# Altium schematic sheet 5V.SchDoc
size A4
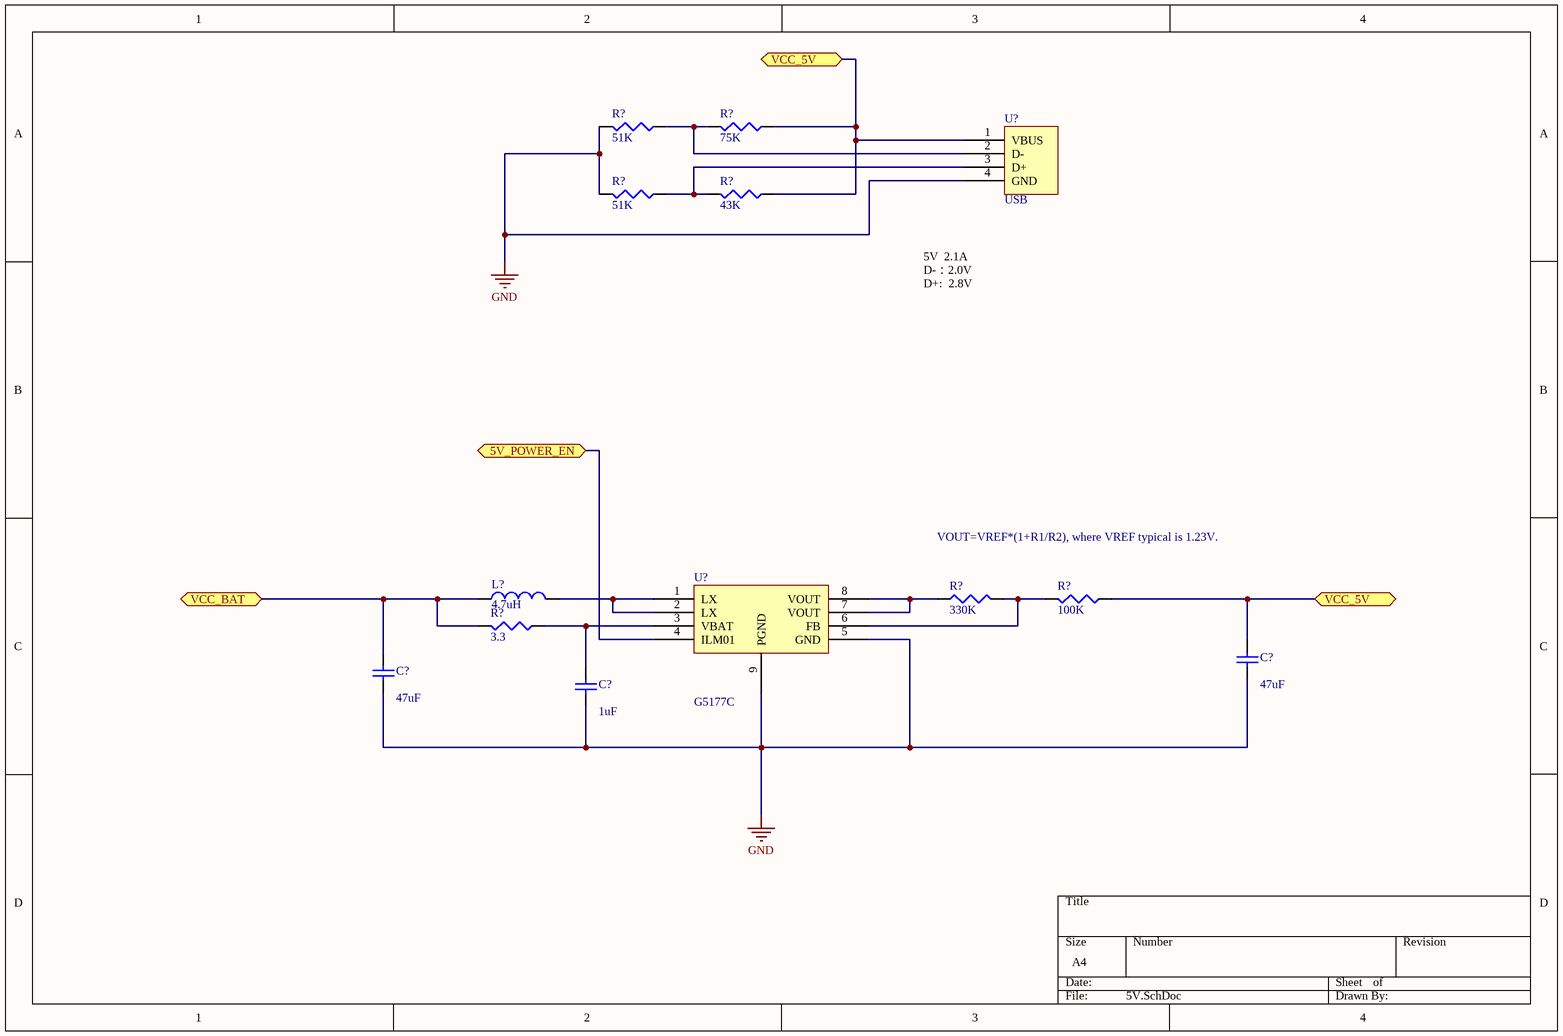
[diagram p0: 5V.SchDoc]

## Parts
(Parts that share a designator on the sheet are numbered #1, #2 ... from top to bottom, then left to right.)
C?#1  value 47uF  [C1206]  (hidden comment: Cap Semi)
C?#2  value 47uF  [C1206]  (hidden comment: Cap Semi)
C?#3  value 1uF  [C1206]  (hidden comment: Cap Semi)
L?  value 4.7uH  [0402-A]  (hidden comment: Inductor)
R?#1  value 51K  [12Z-2010]  (hidden comment: Res3)
R?#2  value 75K  [12Z-2010]  (hidden comment: Res3)
R?#3  value 51K  [12Z-2010]  (hidden comment: Res3)
R?#4  value 43K  [12Z-2010]  (hidden comment: Res3)
R?#5  value 330K  [12Z-2010]  (hidden comment: Res3)
R?#6  value 100K  [12Z-2010]  (hidden comment: Res3)
R?#7  value 3.3  [12Z-2010]  (hidden comment: Res3)
U?#1  USB
U?#2  G5177C

## Ports
5V_POWER_EN (bidir), VCC_5V (bidir), VCC_BAT (bidir)

## Nets
GND: C?#1.1 C?#2.1 C?#3.1 R?#1.2 R?#3.2 U?#1.4(GND) U?#2.5(GND) U?#2.9(PGND)
5V_POWER_EN: U?#2.4(ILM01) ; port 5V_POWER_EN
VCC_5V: C?#1.2 R?#2.1 R?#4.1 R?#6.1 U?#1.1(VBUS) ; port VCC_5V
VCC_BAT: C?#2.2 L?.1 R?#7.2 ; port VCC_BAT
NetC?#3_2: C?#3.2 R?#7.1 U?#2.3(VBAT)
NetL?_2: L?.2 U?#2.1(LX) U?#2.2(LX)
NetR?#1_1: R?#1.1 R?#2.2 U?#1.2(D-)
NetR?#3_1: R?#3.1 R?#4.2 U?#1.3(D+)
NetR?#5_1: R?#5.1 U?#2.7(VOUT) U?#2.8(VOUT)
NetR?#5_2: R?#5.2 R?#6.2 U?#2.6(FB)

## Notes on the sheet
- 5V  2.1A
  D-：2.0V
  D+:  2.8V
- VOUT=VREF*(1+R1/R2), where VREF typical is 1.23V.

## Library data of the parts
C?#1-C?#3 = Cap Semi: Capacitor (Semiconductor SIM Model); Published: 8-Jun-2000; LatestRevisionDate: 29-May-2009; LatestRevisionNote: IPC-7351 Footprint Added.; PackageReference: C1206; Publisher: Altium Limited; PackageDescription: Chip Capacitor
L? = Inductor: Code_IEC: 1005; Published: 8-Jun-2000; LatestRevisionDate: 29-May-2009; LatestRevisionNote: IPC-7351 Footprint Added.; PackageReference: 0402-A; Publisher: Altium Limited; PackageDescription: Chip Inductor; Code_JEITA: 0402
R?#1-R?#7 = Res3: Resistor; Published: 8-Jun-2000; LatestRevisionDate: 29-May-2009; LatestRevisionNote: IPC-7351 Footprint Added.; PackageReference: J1-0603; Publisher: Altium Limited; PackageDescription: Chip Resistor